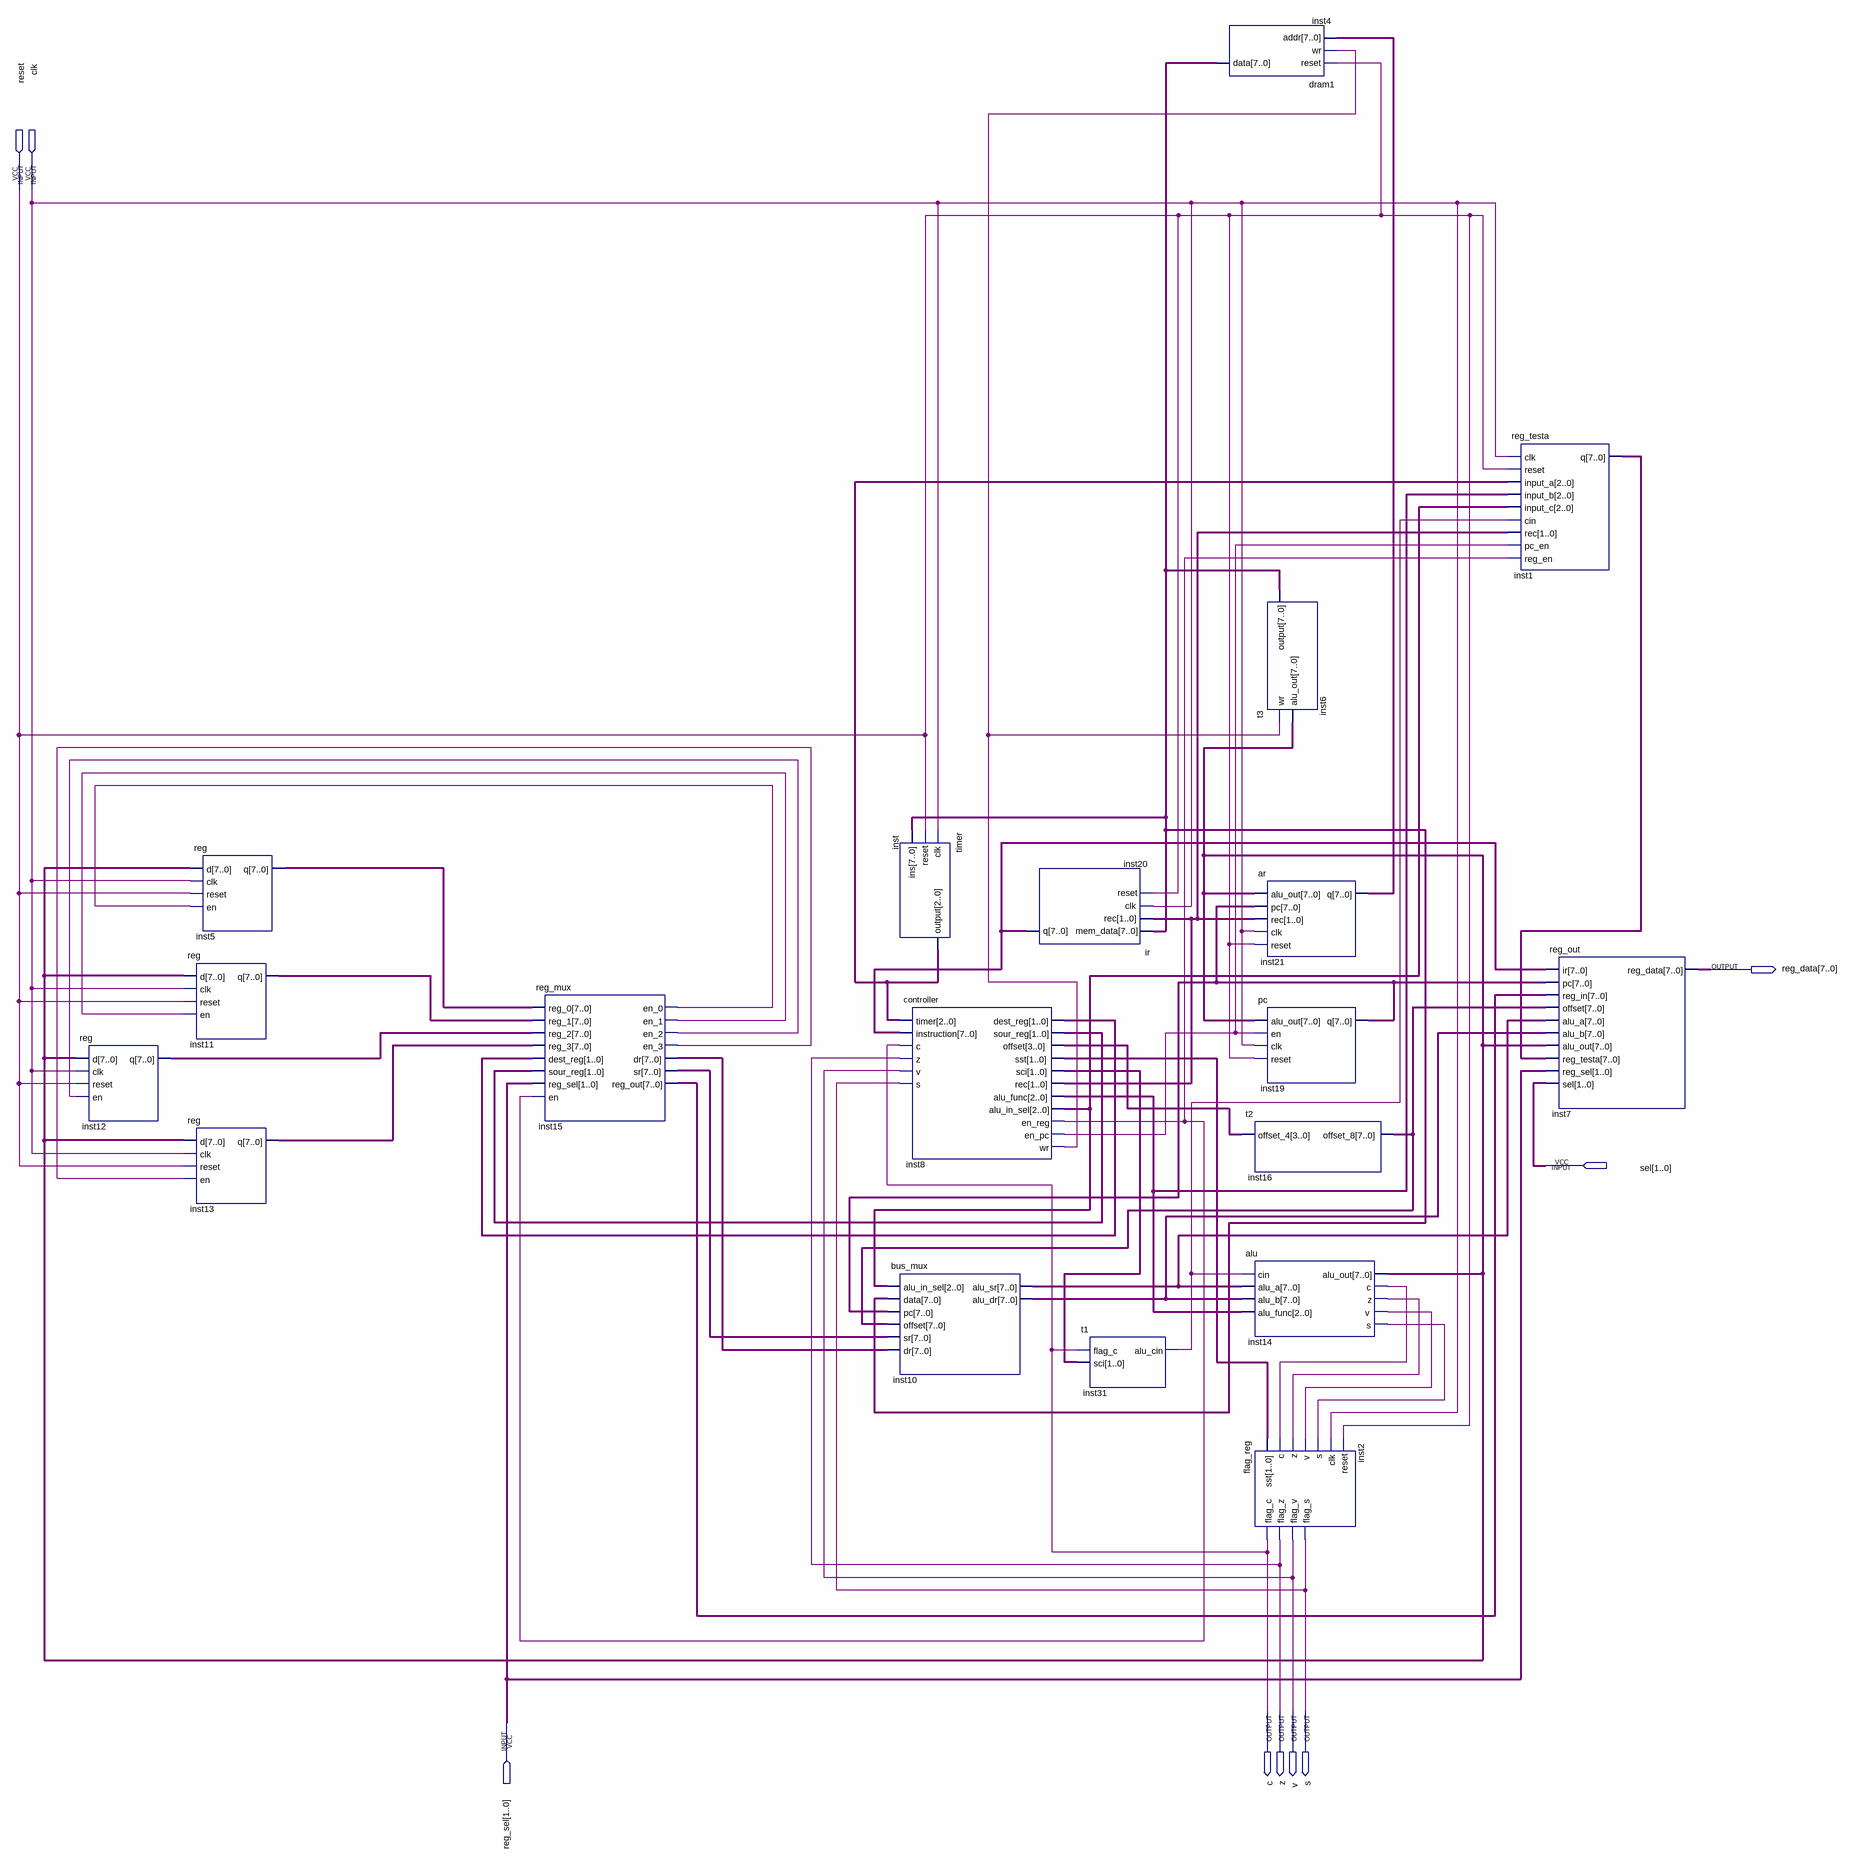
[diagram p0: schematic sheet]
// Quartus schematic cpu2.bdf as structural Verilog: 19 symbols, 9 pins
module cpu2 (
  input  reset,
  input  clk,
  input  [1:0] sel,
  input  [1:0] reg_sel,
  output [7:0] reg_data,
  output c,
  output z,
  output v,
  output s
);

  wire inst8_en_pc, inst8_en_reg, inst8_wr, inst14_c, inst14_s, inst14_v, inst14_z, inst15_en_0, inst15_en_1,
       inst15_en_2, inst15_en_3, inst31_alu_cin;
  wire [1:0] inst8_dest_reg, inst8_rec, inst8_sci, inst8_sour_reg, inst8_sst;
  wire [2:0] inst8_alu_func, inst8_alu_in_sel, inst_output;
  wire [3:0] inst8_offset;
  wire [7:0] inst1_q, inst4_data, inst5_q, inst10_alu_dr, inst10_alu_sr, inst11_q, inst12_q, inst13_q,
       inst14_alu_out, inst15_dr, inst15_reg_out, inst15_sr, inst16_offset_8, inst19_q, inst20_q, inst21_q;

  \reg  inst12 (.d(inst14_alu_out), .clk(clk), .reset(reset), .en(inst15_en_2), .q(inst12_q));
  \reg  inst5 (.d(inst14_alu_out), .clk(clk), .reset(reset), .en(inst15_en_0), .q(inst5_q));
  \reg  inst11 (.d(inst14_alu_out), .clk(clk), .reset(reset), .en(inst15_en_1), .q(inst11_q));
  \reg  inst13 (.d(inst14_alu_out), .clk(clk), .reset(reset), .en(inst15_en_3), .q(inst13_q));
  reg_mux inst15 (
    .reg_0(inst5_q), .reg_1(inst11_q), .reg_2(inst12_q), .reg_3(inst13_q), .dest_reg(inst8_dest_reg),
    .sour_reg(inst8_sour_reg), .reg_sel(reg_sel), .en(inst8_en_reg), .en_0(inst15_en_0), .en_1(inst15_en_1),
    .en_2(inst15_en_2), .en_3(inst15_en_3), .dr(inst15_dr), .sr(inst15_sr), .reg_out(inst15_reg_out));
  timer inst (.clk(clk), .reset(reset), .ins(inst4_data), .\output (inst_output));
  controller inst8 (
    .timer(inst_output), .instruction(inst20_q), .c(c), .z(z), .v(v), .s(s), .dest_reg(inst8_dest_reg),
    .sour_reg(inst8_sour_reg), .offset(inst8_offset), .sst(inst8_sst), .sci(inst8_sci), .rec(inst8_rec),
    .alu_func(inst8_alu_func), .alu_in_sel(inst8_alu_in_sel), .en_reg(inst8_en_reg), .en_pc(inst8_en_pc),
    .wr(inst8_wr));
  bus_mux inst10 (
    .alu_in_sel(inst8_alu_in_sel), .data(inst4_data), .pc(inst19_q), .offset(inst16_offset_8),
    .sr(inst15_sr), .dr(inst15_dr), .alu_sr(inst10_alu_sr), .alu_dr(inst10_alu_dr));
  ir inst20 (.mem_data(inst4_data), .rec(inst8_rec), .clk(clk), .reset(reset), .q(inst20_q));
  t1 inst31 (.flag_c(c), .sci(inst8_sci), .alu_cin(inst31_alu_cin));
  dram1 inst4 (.reset(reset), .wr(inst8_wr), .addr(inst21_q), .data(inst4_data));
  t3 inst6 (.wr(inst8_wr), .alu_out(inst14_alu_out), .\output (inst4_data));
  ar inst21 (.alu_out(inst14_alu_out), .pc(inst19_q), .rec(inst8_rec), .clk(clk), .reset(reset), .q(inst21_q));
  pc inst19 (.alu_out(inst14_alu_out), .en(inst8_en_pc), .clk(clk), .reset(reset), .q(inst19_q));
  t2 inst16 (.offset_4(inst8_offset), .offset_8(inst16_offset_8));
  alu inst14 (
    .cin(inst31_alu_cin), .alu_a(inst10_alu_sr), .alu_b(inst10_alu_dr), .alu_func(inst8_alu_func),
    .alu_out(inst14_alu_out), .c(inst14_c), .z(inst14_z), .v(inst14_v), .s(inst14_s));
  flag_reg inst2 (
    .sst(inst8_sst), .c(inst14_c), .z(inst14_z), .v(inst14_v), .s(inst14_s), .clk(clk), .reset(reset),
    .flag_c(c), .flag_z(z), .flag_v(v), .flag_s(s));
  reg_testa inst1 (
    .clk(clk), .reset(reset), .input_a(inst_output), .input_b(inst8_alu_func), .input_c(inst8_alu_in_sel),
    .cin(inst31_alu_cin), .rec(inst8_rec), .pc_en(inst8_en_pc), .reg_en(inst8_en_reg), .q(inst1_q));
  reg_out inst7 (
    .ir(inst20_q), .pc(inst19_q), .reg_in(inst15_reg_out), .offset(inst16_offset_8), .alu_a(inst10_alu_sr),
    .alu_b(inst10_alu_dr), .alu_out(inst14_alu_out), .reg_testa(inst1_q), .reg_sel(reg_sel), .sel(sel),
    .reg_data(reg_data));
endmodule
